# Altium schematic sheet Notch_schematic.SchDoc
size A4
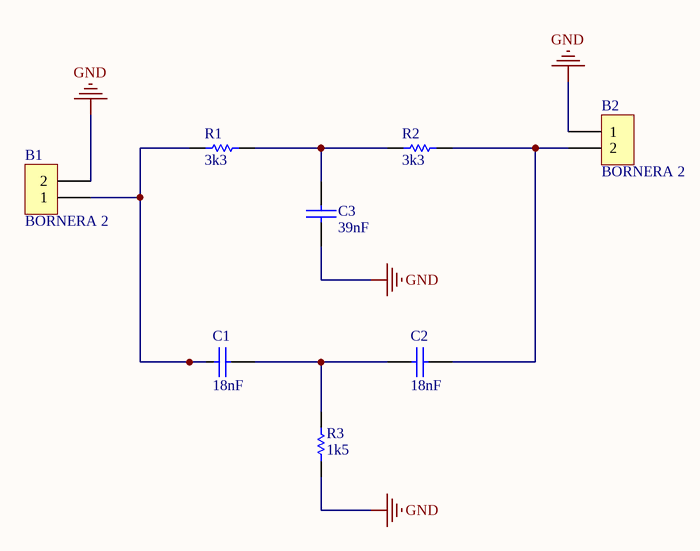
[diagram p0: Notch_schematic.SchDoc]

## Parts
B1  BORNERA 2  [BORNERA2]
B2  BORNERA 2  [BORNERA2]
C1  18nF  [CAP200]
C2  18nF  [CAP200]
C3  39nF  [CAP200]
R1  3k3  [RES400]
R2  3k3  [RES400]
R3  1k5  [RES400]

## Nets
GND: B1.2 B2.1 C3.2 R3.1
NetB1_1: B1.1 C1.1 R1.1
NetB2_2: B2.2 C2.2 R2.2
NetC1_2: C1.2 C2.1 R3.2
NetC3_1: C3.1 R1.2 R2.1

## Library data of the parts
C1-C3 = CAP
R1-R3 = RES